# EAGLE design lego_motors_booster_1x4- (EAGLE 7.7.0)
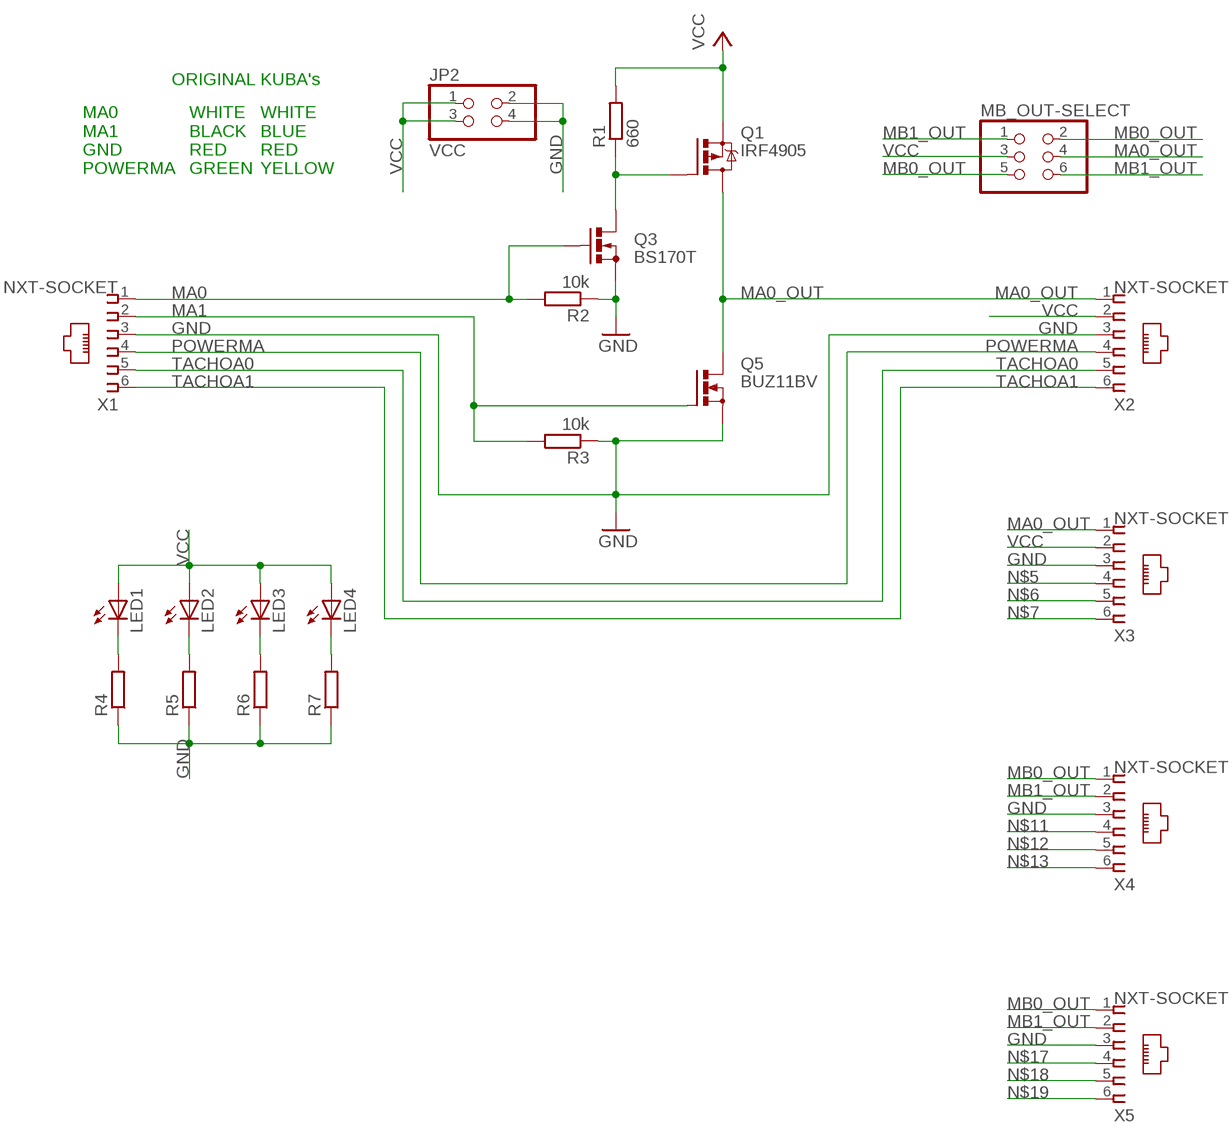
[diagram p0: schematic, sheet 1]

## Parts
JP2  VCC  PINHD-2X2  [2X02]
LED1  LEDSML0603  [SML0603]
LED2  LEDSML0603  [SML0603]
LED3  LEDSML0603  [SML0603]
LED4  LEDSML0603  [SML0603]
MB_OUT-SELECT  PINHD-2X3  [2X03]
Q1  IRF4905  IRF9530  [TO220BV]
Q3  BS170T  [SOT54E]
Q5  BUZ11BV  [TO220BV]
R1  660  R-EU_0204/7  [0204/7]
R2  10k  R-EU_0204/7  [0204/7]
R3  10k  R-EU_0204/7  [0204/7]
R4  R-EU_R0603  [R0603]
R5  R-EU_R0603  [R0603]
R6  R-EU_R0603  [R0603]
R7  R-EU_R0603  [R0603]
X1  NXT-SOCKET  [NXT-SOCKET]
X2  NXT-SOCKET  [NXT-SOCKET]
X3  NXT-SOCKET  [NXT-SOCKET]
X4  NXT-SOCKET  [NXT-SOCKET]
X5  NXT-SOCKET  [NXT-SOCKET]

## Nets
GND: JP2.2 JP2.4 Q3.S Q5.S R2.1 R3.1 R4.1 R5.1 R6.1 R7.1 X1.3 X2.3 X3.3 X4.3 X5.3
MA0: Q3.G R2.2 X1.1
MA0_OUT: MB_OUT-SELECT.4 Q1.D Q5.D X2.1 X3.1
MA1: Q5.G R3.2 X1.2
MB0_OUT: MB_OUT-SELECT.2 MB_OUT-SELECT.5 X4.1 X5.1
MB1_OUT: MB_OUT-SELECT.1 MB_OUT-SELECT.6 X4.2 X5.2
N$1: Q1.G Q3.D R1.1
N$3: LED1.C R4.2
N$4: LED2.C R5.2
N$5: X3.4
N$6: X3.5
N$7: X3.6
N$8: LED3.C R6.2
N$9: LED4.C R7.2
N$11: X4.4
N$12: X4.5
N$13: X4.6
N$17: X5.4
N$18: X5.5
N$19: X5.6
POWERMA: X1.4 X2.4
TACHOA0: X1.5 X2.5
TACHOA1: X1.6 X2.6
VCC: JP2.1 JP2.3 LED1.A LED2.A LED3.A LED4.A MB_OUT-SELECT.3 Q1.S R1.2 X2.2 X3.2

## Notes on the sheet
- ORIGINAL | KUBA's
- MA0
  MA1
  GND
  POWERMA
- WHITE
  BLACK
  RED
  GREEN
- WHITE
  BLUE
  RED
  YELLOW

## Library data of the parts
JP2 = pinhead:PINHD-2X2: PIN HEADER
LED1-LED4 = led:LED: LED OSRAM: - CHIPLED LG R971, LG N971, LY N971, LG Q971, LY Q971, LO R971, LY R971 LH N974, LH R974 LS Q976, LO Q976, LY Q976 LO Q996 - Hyper CHIPLED LW Q18S LB Q993, LB Q99A, LB R99A - SideLED LS A670, LO A670, LY A670, LG A670, LP A670 LB A673, LV A673, LT A673, LW A673 LH A674 LY A675 LS A676, LA A676, LO A676, LY A676, LW A676 LS A679, LY A679, LG A679 - Hyper Micro SIDELED® LS Y876, LA Y876, LO Y876, LY Y876 LT Y87S - SmartLED LW L88C, LW L88S LB L89C, LB L89S, LG L890 LS L89K, LO L89K, LY L89K LS L896, LA L896, LO L896, LY L896 - TOPLED LS T670, LO T670, LY T670, LG T670, LP T670 LSG T670, LSP T670, LSY T670, LOP T670, LYG T670 LG T671, LOG T671, LSG T671 LB T673, LV T673, LT T673, LW T673 LH T674 LS T676, LA T676, LO T676, LY T676, LB T676, LH T676, LSB T676, LW T676 LB T67C, LV T67C, LT T67C, LS T67K, LO T67K, LY T67K, LW E67C LS E67B, LA E67B, LO E67B, LY E67B, LB E67C, LV E67C, LT E67C LW T67C LS T679, LY T679, LG T679 LS T770, LO T770, LY T770, LG T770, LP T770 LB T773, LV T773, LT T773, LW T773 LH T774 LS E675, LA E675, LY E675, LS T675 LS T776, LA T776, LO T776, LY T776, LB T776 LHGB T686 LT T68C, LB T68C - Hyper Mini TOPLED® LB M676 - Mini TOPLED Santana® LG M470 LS M47K, LO M47K, LY M47K Source: http://www.osram.convergy.de LUXEON: - LUMILED® LXK2-PW12-R00, LXK2-PW12-S00, LXK2-PW14-U00, LXK2-PW14-V00 LXK2-PM12-R00, LXK2-PM12-S00, LXK2-PM14-U00 LXK2-PE12-Q00, LXK2-PE12-R00, LXK2-PE12-S00, LXK2-PE14-T00, LXK2-PE14-U00 LXK2-PB12-K00, LXK2-PB12-L00, LXK2-PB12-M00, LXK2-PB14-N00, LXK2-PB14-P00, LXK2-PB14-Q00 LXK2-PR12-L00, LXK2-PR12-M00, LXK2-PR14-Q00, LXK2-PR14-R00 LXK2-PD12-Q00, LXK2-PD12-R00, LXK2-PD12-S00 LXK2-PH12-R00, LXK2-PH12-S00 LXK2-PL12-P00, LXK2-PL12-Q00, LXK2-PL12-R00 Source: www.luxeon.com KINGBRIGHT: KA-3528ASYC Source: www.kingbright.com
MB_OUT-SELECT = pinhead:PINHD-2X3: PIN HEADER
Q1 = transistor-power:IRF9530: P-CHANNEL HEXFET POWER-MOS-FET Source: http://www.irf.com/product-info/datasheets/data/irf9530.pdf
Q3 = gm-trans:BS170: N-CHANNEL MOS FET
Q5 = transistor-power:BUZ11: N-CHANNEL MOS FET
R1-R7 = rcl:R-EU_: RESISTOR, European symbol
X1-X5 = NXT Compatible (female) Sockets - Mindsensors:NXT-SOCKET: RJ11 6 connects Manufacturer: Mindsensors.com Source: NXT-Female-Socket.pdf; OC_FARNELL: unknown; OC_NEWARK: unknown

## Board
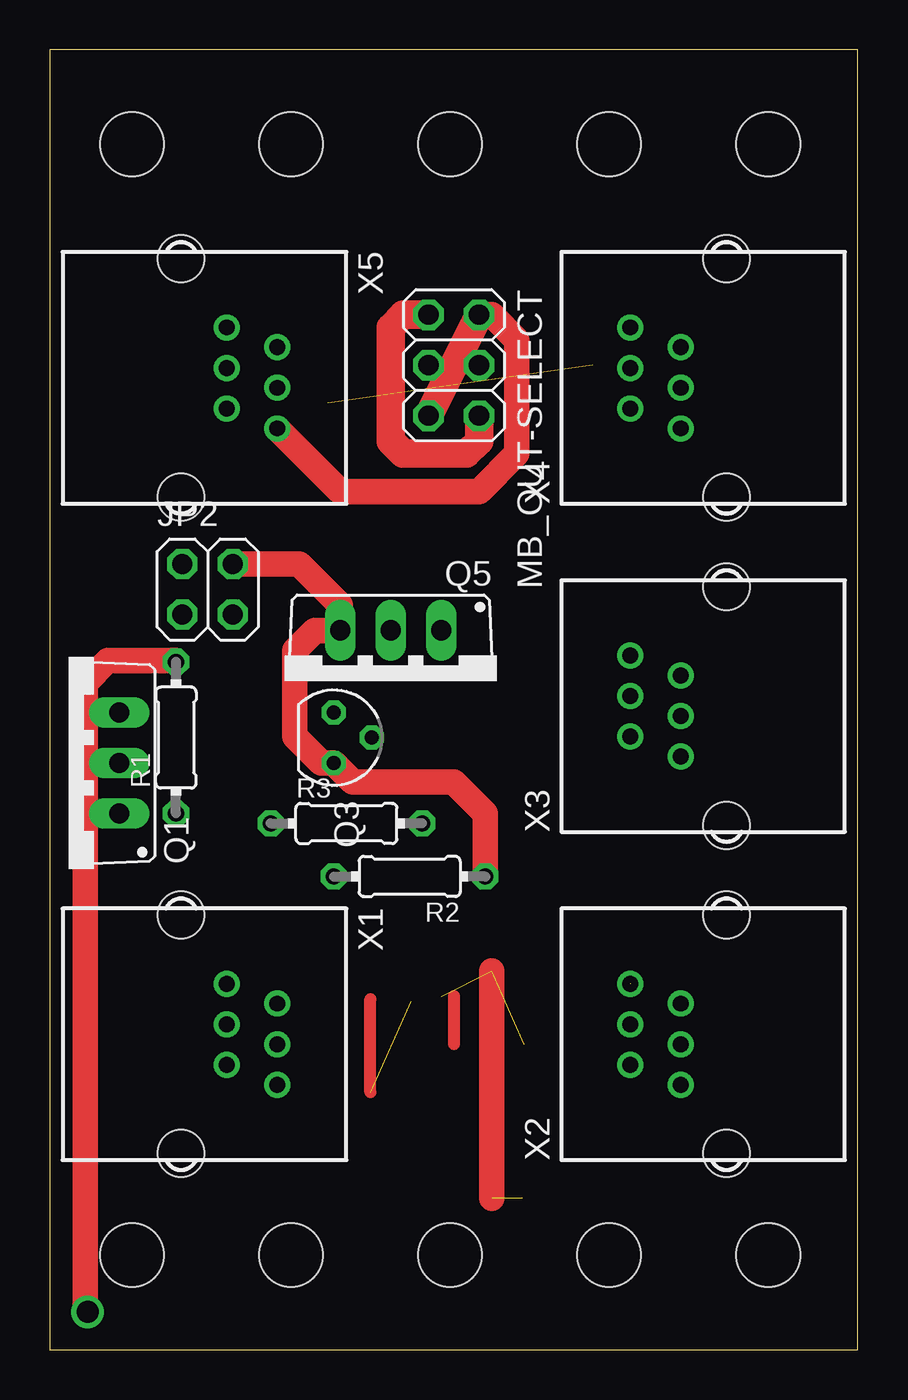
[diagram p1: board, top side]
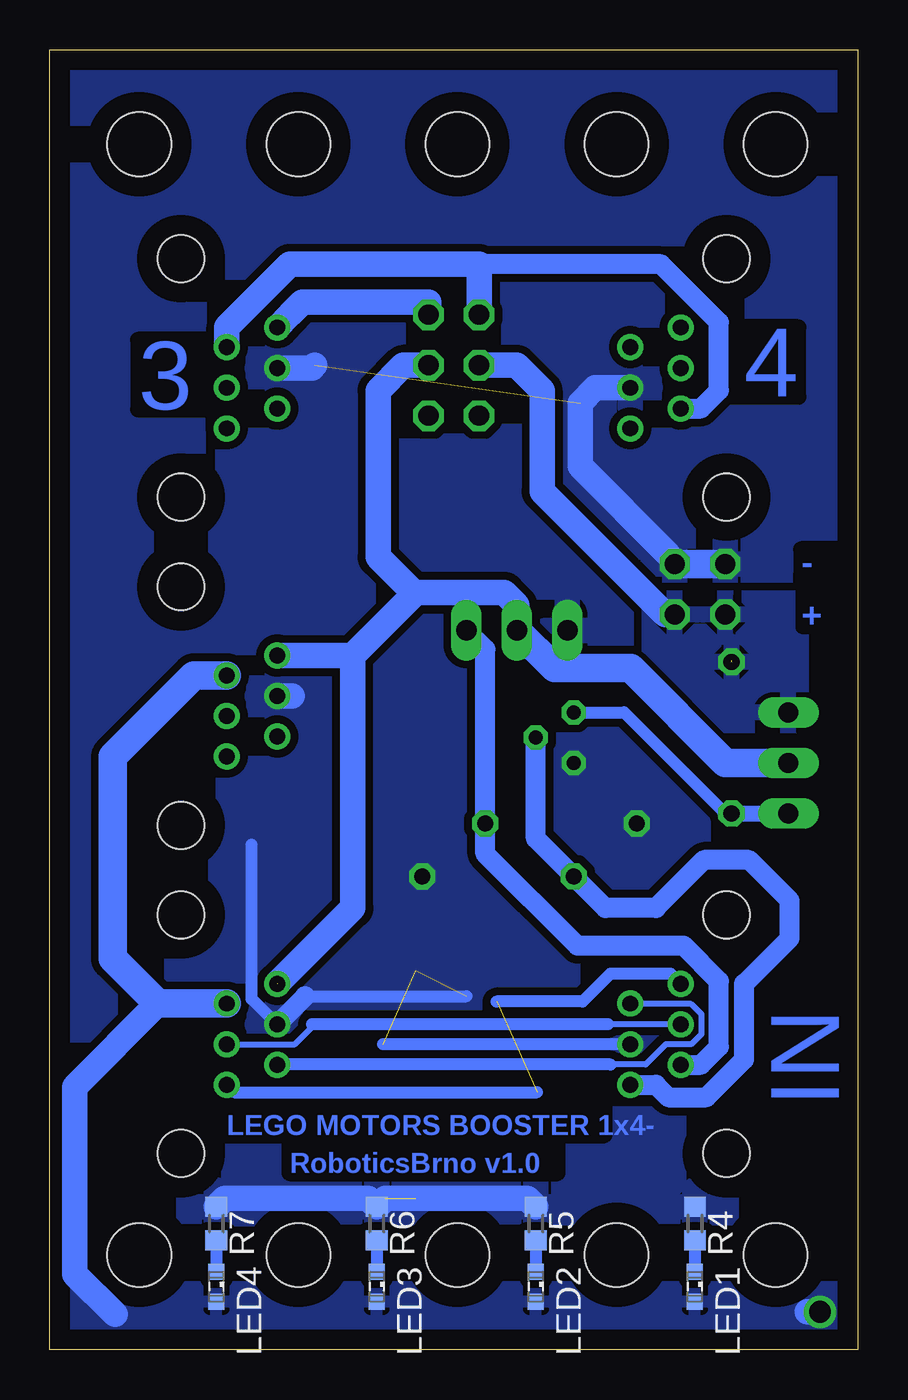
[diagram p2: board, bottom side, seen from below]

Size 40.64 x 65.41 mm. Coordinates in mm from the lower left corner, seen from the top.
Outline: 0,0 40.64,0 40.64,65.41 0,65.41 0,0
Copper layers (1+16): Top 0.035mm / dielectric 1.5mm / Bottom 0.035mm
Design rules "default *": minimum track width 0.2mm, minimum drill 24mil, track to track 0.2mm, track to pad 0.2mm, pad to pad 0.2mm, via to via 0.2mm, smd to smd 0.2mm, copper to edge 40mil, drill to drill 8mil, minimum pad ring 10mil, minimum via ring 8mil, stop-mask expansion 4mil, vias tented up to drill 0mil, thermal gap 10mil
Holes 3.2 mm at 4.13,4.77 36.13,4.77 28.14,4.77 20.14,4.77 12.13,4.77 4.13,60.65 36.13,60.65 28.14,60.65 20.14,60.65 12.13,60.65

### Footprints (pad centres in the part's own frame; a part is rotated, then mirrored left to right if it is on the bottom)
2X02 = drill 1.016 octagon: 1 -1.27,-1.27; 2 -1.27,1.27; 3 1.27,-1.27; 4 1.27,1.27
SML0603 = smd 0.8 x 0.8: A 0.75,0; C -0.75,0
2X03 = drill 1.016 octagon: 1 -2.54,-1.27; 2 -2.54,1.27; 3 0,-1.27; 4 0,1.27; 5 2.54,-1.27; 6 2.54,1.27
TO220BV = drill 1.016 long: D 0,-2.54; G -2.54,-2.54; S 2.54,-2.54
SOT54E = drill 0.7 octagon: D -1.27,0; G 0,1.905; S 1.27,0
0204/7 = drill 0.813 octagon: 1 -3.81,0; 2 3.81,0
R0603 = smd 1 x 1.1: 1 -0.85,0; 2 0.85,0
NXT-SOCKET = drill 0.8 pad 1.3: 1 2.54,10.809; 2 1.54,8.269; 3 0.5,10.809; 4 -0.5,8.269; 5 -1.54,10.809; 6 -2.54,8.269 | hole 2.36: -6,5.969; 6,5.969

### Placement (x,y rotation side)
JP2  7.94,38.26 0 top
LED1  8.19,3.17 270 bottom
LED2  16.19,3.17 270 bottom
LED3  24.19,3.17 270 bottom
LED4  32.26,3.17 270 bottom
MB_OUT-SELECT  20.32,49.53 270 top
Q1  0.95,29.53 90 top
Q3  14.29,30.8 270 top
Q5  17.14,33.66 180 top
R1  6.35,30.8 90 top
R2  18.1,23.81 180 top
R3  14.92,26.48 0 top
R4  8.19,6.35 270 bottom
R5  16.19,6.35 270 bottom
R6  24.19,6.35 270 bottom
R7  32.26,6.35 270 bottom
X1  0.64,15.88 270 top
X2  40.01,15.88 90 top
X3  40.01,32.38 90 top
X4  40.01,48.9 90 top
X5  0.64,48.9 270 top

### Tracks (layer width: path | path; a pad name or v marks a point on that pad's centre or on a via)
GND  (4 unrouted)
  Top 1.27: R2.1 21.91,26.99 20.32,28.57 15.24,28.57 Q3.S 13.65,29.53 12.32,30.86 12.32,35.18 13.34,36.2 Q5.S 14.61,37.47 12.54,39.53 JP2.4 | 22.23,19.05 22.23,7.62
  Bottom 0.61: X1.3 23.87,15.38 23.88,15.37 | 27.79,17.78 19.68,17.78 | X2.3 30.35,17.53 30.48,17.65 30.48,25.4
  Bottom 1.016: X2.3 27.79,17.78
  Bottom 1.27: X4.3 27.44,49.4 27.3,49.53 | X3.3 28.44,32.88 | X5.3 13.2,48.4 13.97,47.62 13.97,44.45 9.53,40.01 | R5.1 16.61,7.62 23.77,7.62 R6.1 24.61,7.62 31.84,7.62 R7.1
  Bottom 1.422: JP2.4 JP2.2
  pour Bottom (isolate 0.4, rank 2): 0,0 40.64,0 40.64,65.41 0,65.41
MA0
  Bottom 1.016: X1.1 10.16,13.33 9.53,12.7 7.62,12.7 5.71,14.61 5.71,18.41 3.43,20.7 3.43,22.61 5.46,24.64 7.75,24.64 10.16,22.22 12.7,22.22 R2.2 16.19,25.72 Q3.G
MA0_OUT  (1 unrouted)
  Bottom 1.27: 29.2,18.43 25.4,22.22 25.4,34.93 | X3.1 25.4,34.93 | 22.29,38.04 25.4,34.93 | MB_OUT-SELECT.4 22.86,49.53 24.13,48.26 24.13,39.88 22.29,38.04 | Q5.D 17.14,37.47 17.78,38.1 22.23,38.1 22.29,38.04
  Bottom 1.422: Q1.D 6.67,29.53 11.43,34.29 15.24,34.29 Q5.D
MA1
  Bottom 1.016: X1.2 7.89,14.33 6.99,15.24 6.99,18.54 8.76,20.32 14.1,20.32 18.73,24.96 R3.2 18.73,35.24 Q5.G
MB0_OUT
  Top 1.27: X5.1 14.62,43.18 21.59,43.18 23.5,45.09 23.5,50.8 22.23,52.07 MB_OUT-SELECT.2
  Top 1.422: MB_OUT-SELECT.5 MB_OUT-SELECT.2
  Bottom 1.27: MB_OUT-SELECT.2 21.59,52.71 27.94,52.71 28.56,52.08 28.56,52.07 X4.1
MB1_OUT
  Top 1.422: MB_OUT-SELECT.6 21.59,45.72 20.95,45.09 17.78,45.09 17.14,45.72 17.14,51.44 17.78,52.07 MB_OUT-SELECT.1
  Bottom 1.016: X5.2 7.89,47.36 6.99,48.26 6.99,51.69 9.91,54.61 19.05,54.61
  Bottom 1.27: X4.2 31.74,51.45 28.57,54.61 19.05,54.61 MB_OUT-SELECT.1
N$1
  Bottom 0.61: Q3.D 11.75,32.07 6.67,26.99
  Bottom 0.813: Q1.G R1.1 6.67,26.99
N$3
  Bottom 0.61: R4.2 LED1.C
N$4
  Bottom 0.61: R5.2 LED2.C
N$8
  Bottom 0.61: R6.2 LED3.C
N$9
  Bottom 0.61: R7.2 LED4.C
N$14
  Top 0.61: 20.32,17.78 20.32,15.37
N$15
  Top 0.61: 16.13,12.95 16.13,17.65
POWERMA
  Bottom 0.305: X1.4 8.91,16.38 12.57,16.38 | X2.4 28.31,15.38 27.3,16.38
  Bottom 0.61: 12.57,16.38 27.3,16.38 27.43,16.38 27.44,16.38
TACHOA0
  Bottom 0.305: X1.5 10.87,17.41 10.86,17.4 8.38,17.4 7.87,16.89 7.87,15.88 8.38,15.37 9.65,15.37 10.67,14.35 12.45,14.35
  Bottom 0.61: 12.45,14.35 29.18,14.35 X2.5
TACHOA1  (1 unrouted)
  Bottom 0.61: X2.6 31.36,12.95 16.13,12.95 | X1.6 9.41,18.92 12.45,18.92 13.84,17.53 18.16,17.53
VCC  (via drill 1.1)  (1 unrouted)
  Top 1.27: 6.35,34.67 2.92,34.67 1.78,33.53 1.78,2.03 v1.91,1.91
  Bottom 1.27: MB_OUT-SELECT.3 17.14,49.53 15.88,48.26 15.88,43.18 9.68,36.99 JP2.3 | 37.35,1.79 39.37,3.81 39.37,13.24 35.2,17.41 | v1.91,1.91 2.54,1.91
  Bottom 1.422: X3.2 33.38,33.93 37.47,29.84 37.47,19.68 35.2,17.41 X2.2
  pour Bottom (isolate 0.3): 10.48,37.78 10.48,35.24 6.67,31.43 2.86,31.43 2.86,37.78
  pour Bottom (isolate 0.4): 0,0 40.64,0 40.64,3.17 0,3.17

### Text on the board
Bottom: 4 | 3 | - | + | IN | LEGO MOTORS BOOSTER 1x4- | RoboticsBrno v1.0